# EasyEDA schematic SCH.json

## Sheets
1 power: TITLE: Power; REV: 1.0; Date: 2026-07-29; Sheet: 1/1; Drawn By: rabieulawal.h; Company: Your Company
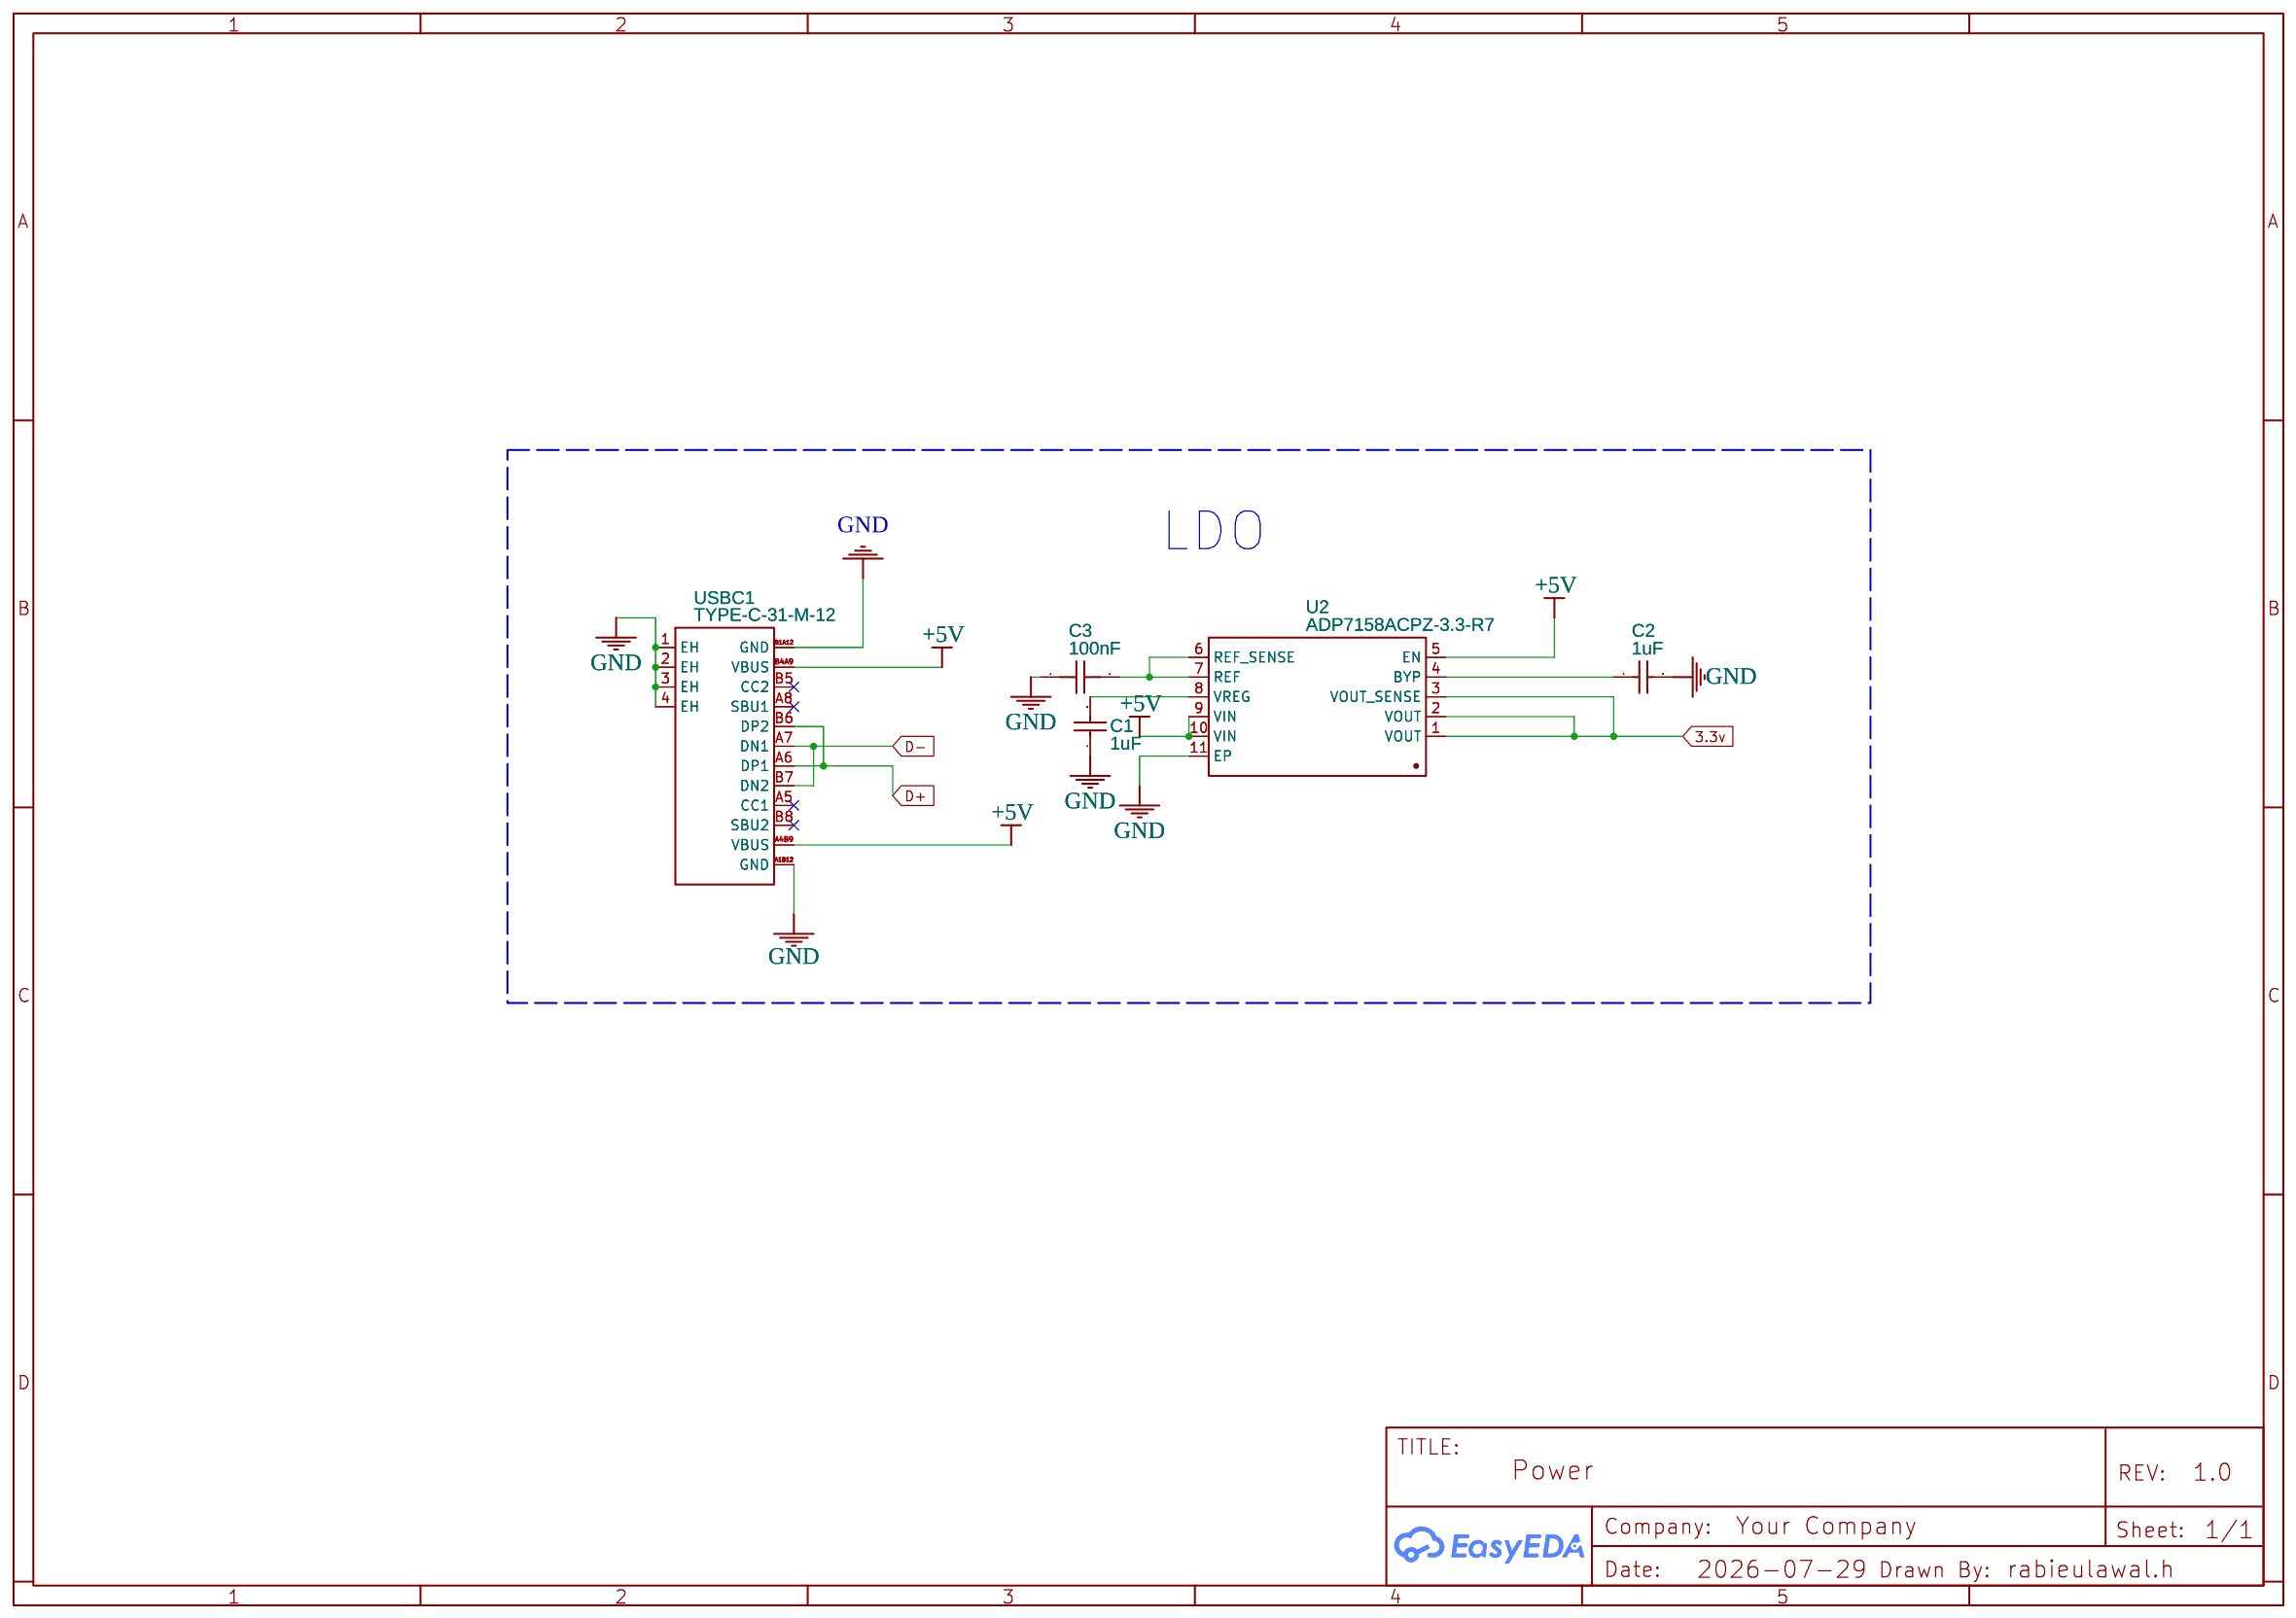
[diagram p0: power]
2 MCU: TITLE: Sheet_1
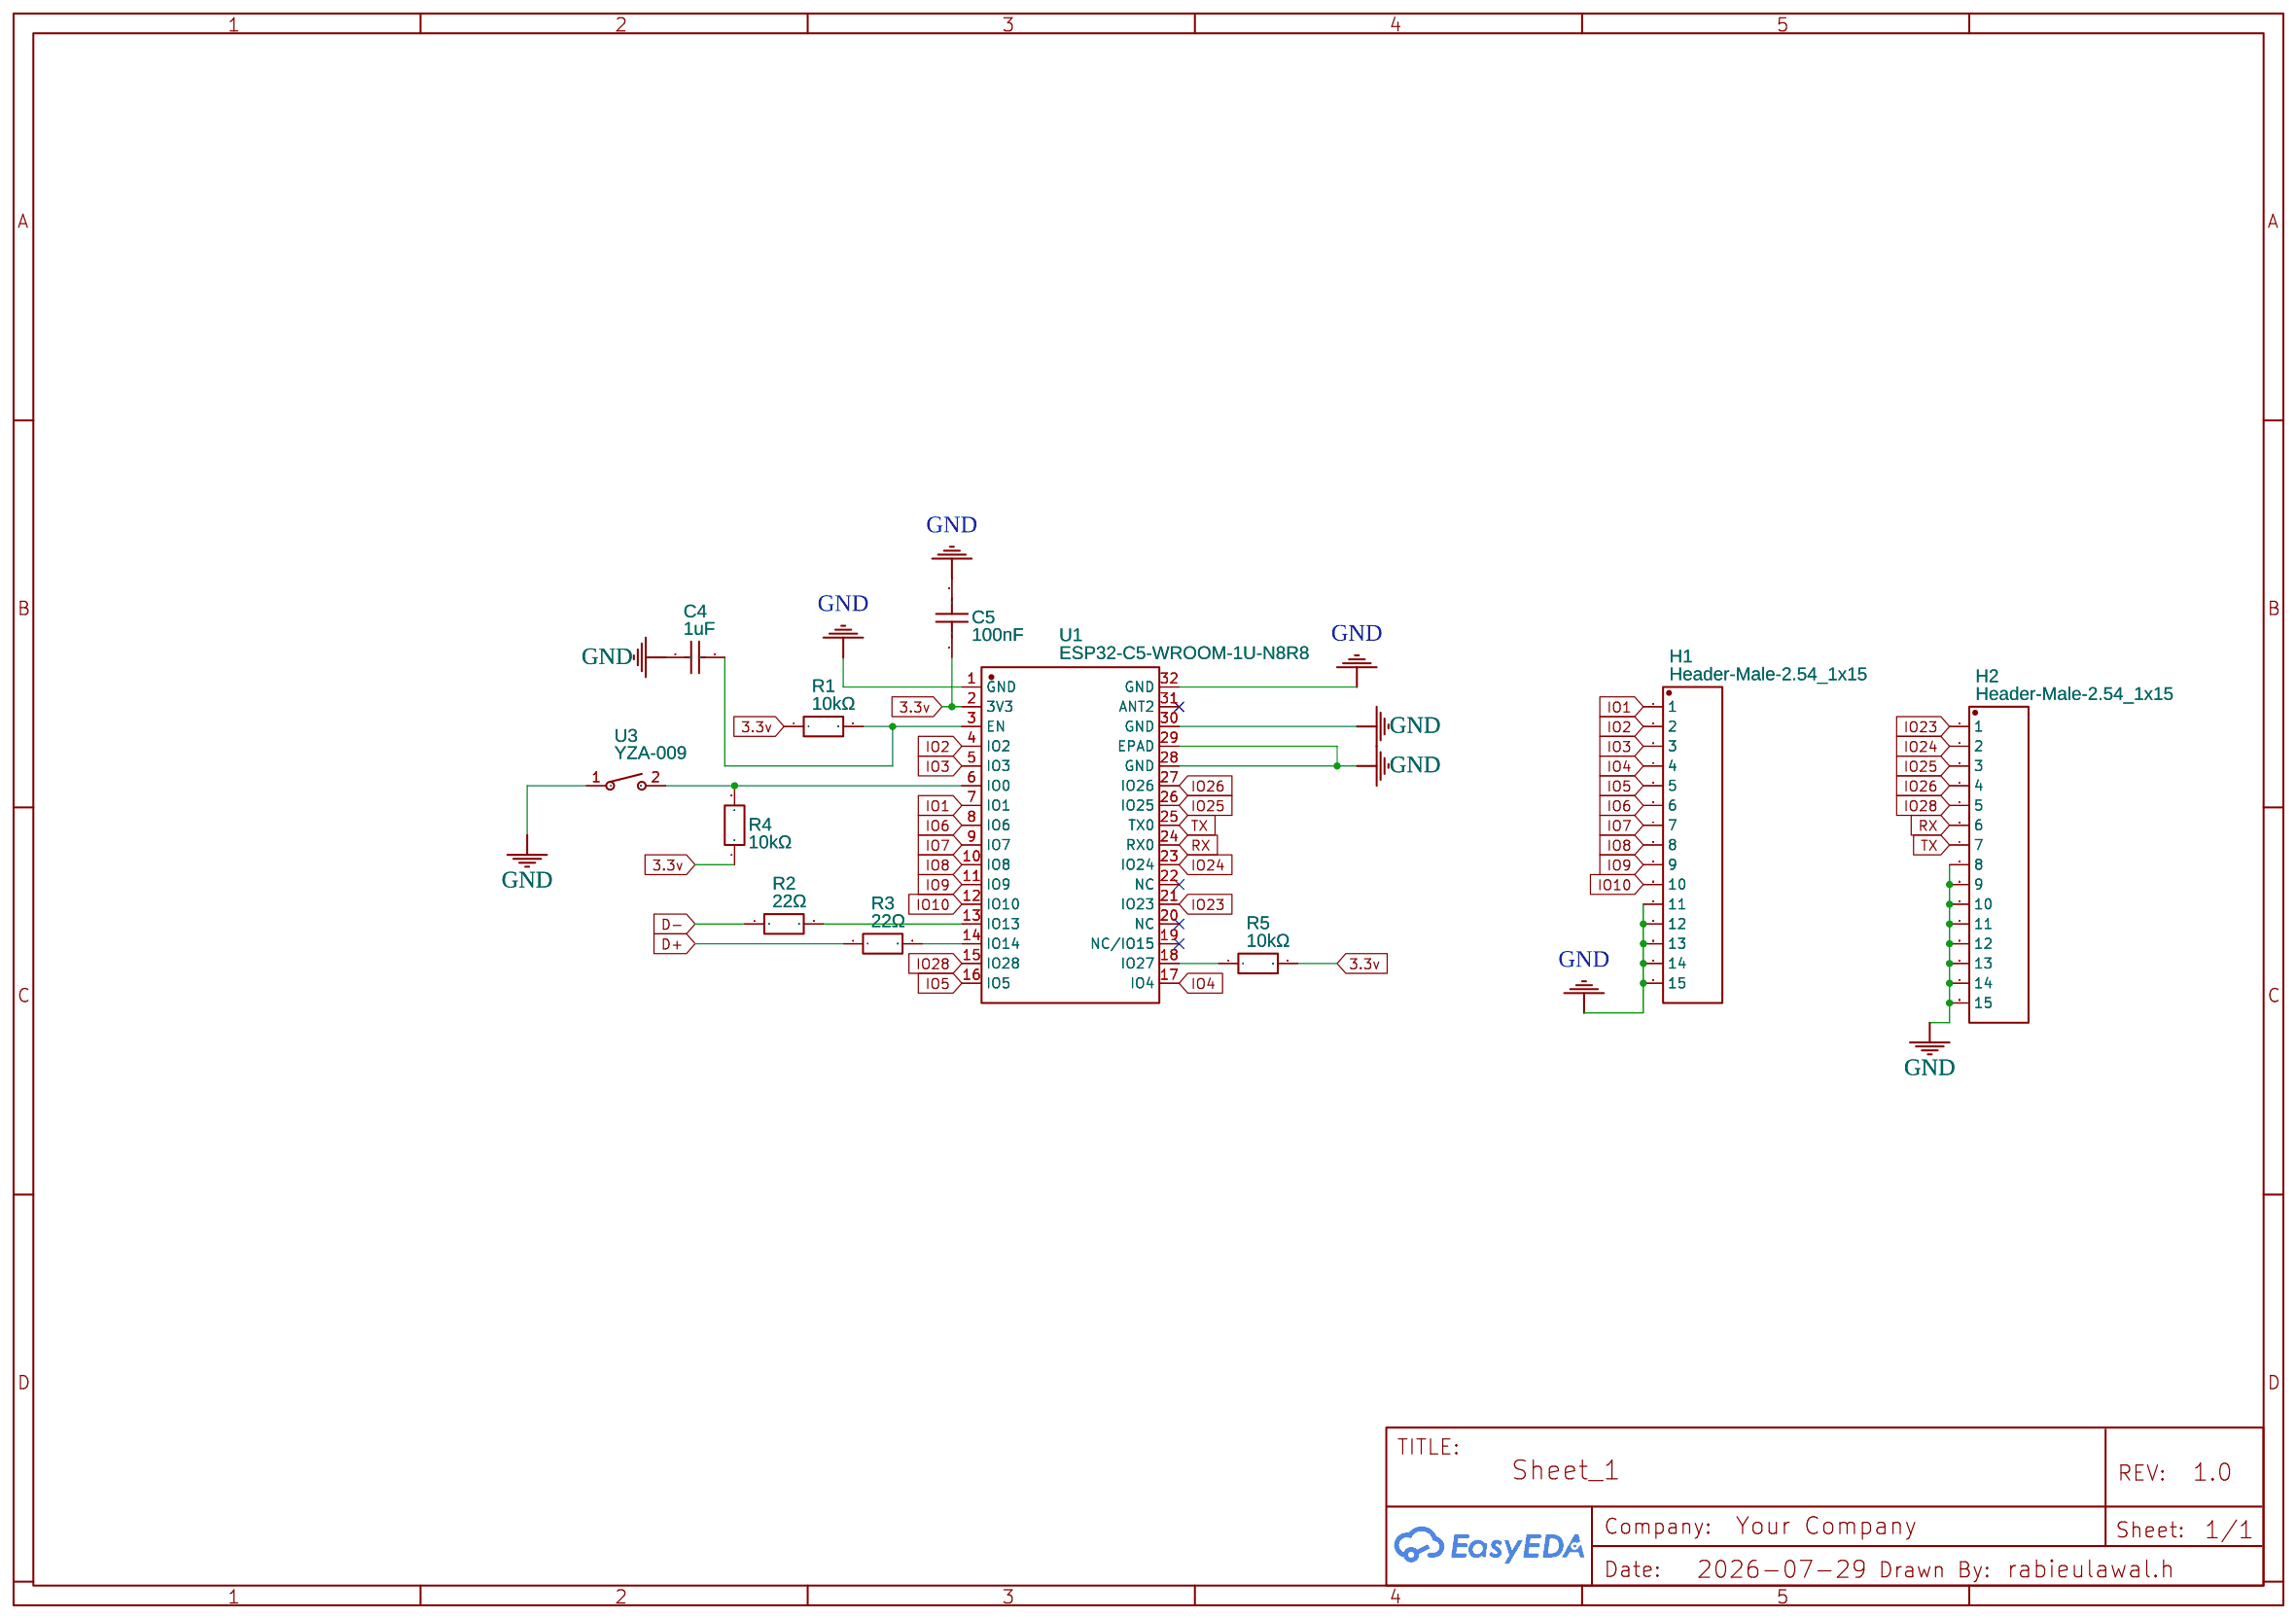
[diagram p1: MCU]

## Parts
sheet MCU
C4  1uF  [C0402]
C5  100nF  [C0402]
H1  Header-Male-2.54_1x15  [HDR-TH_15P-P2.54-V-M]
H2  Header-Male-2.54_1x15  [HDR-TH_15P-P2.54-V-M]
R1  10kΩ  [R0402]
R2  22Ω  [R0805]
R3  22Ω  [R0805]
R4  10kΩ  [R0402]
R5  10kΩ  [R0402]
U1  ESP32-C5-WROOM-1U-N8R8  [COMM-SMD_32P-L21.2-W18.0_ESP32-C5-WROOM-1U]
U3  YZA-009  [SW-SMD_YZA-009]
sheet power
C1  1uF  [C0402]
C2  1uF  [C0402]
C3  100nF  [C0402]
U2  ADP7158ACPZ-3.3-R7  [LFCSP-10_L3.0-W3.0-P0.50-BL-EP]
USBC1  TYPE-C-31-M-12  [USB-C_SMD-TYPE-C-31-M-12_1]

## Library data of the parts
C2 C4 = CL05A105KO5NNNC: Supplier: LCSC; Manufacturer: SAMSUNG(三星); Supplier Part: C29266; JLCPCB Part Class: Extended Part; link: https://lcsc.com/eda_search?q=C29266&%26type=1&ref=editor
C3 C5 = CC0402KRX7R7BB104: Supplier: LCSC; Manufacturer: YAGEO(国巨); Supplier Part: C60474; JLCPCB Part Class: Extended Part
H1 H2 = Header-Male-2.54_1x15: Contributor: LCSC; Supplier: LCSC; Manufacturer: Ckmtw(灿科盟); Manufacturer Part: B-2100S15P-A110; Supplier Part: C124373; JLCPCB Part Class: Extended Part
R1 R4 R5 = FRC0402F1002TS: Contributor: LCSC; Supplier: LCSC; Supplier Part: C2906861; Manufacturer: FOJAN(富捷); JLCPCB Part Class: Extended Part
R2 R3 = FRC0805F22R1TS: Supplier: LCSC; Supplier Part: C2933372; Manufacturer: FOJAN(富捷); JLCPCB Part Class: Extended Part; Contributor: lcsc
U1 = ESP32-C5-WROOM-1U-N8R8: Supplier: LCSC; Supplier Part: C51950748; Manufacturer: ESPRESSIF(乐鑫); JLCPCB Part Class: Extended Part; Contributor: lcsc
U3 = YZA-009: Supplier: LCSC; Supplier Part: C49108621; Manufacturer: YIZHI(逸致); Contributor: lcsc; JLCPCB Part Class: Extended Part
C1 = CL05A105KO5NNNC: Supplier: LCSC; Manufacturer: SAMSUNG(三星); Supplier Part: C29266; JLCPCB Part Class: Extended Part
U2 = ADP7158ACPZ-3.3-R7: Contributor: LCSC; Supplier: LCSC; Supplier Part: C579270; Manufacturer: ADI(亚德诺); JLCPCB Part Class: Extended Part; link: https://lcsc.com/eda_search?q=C579270&%26type=1&ref=editor
USBC1 = TYPE-C-31-M-12: Contributor: LCSC; Supplier: LCSC; Supplier Part: C165948; Manufacturer: 韩国韩荣; JLCPCB Part Class: Extended Part

## Nets
3.3v: C5.1 R1.1 R4.1 R5.2 U1.2(3V3) U2.1(VOUT) U2.2(VOUT) U2.3(VOUT_SENSE)
+5V: U2.5(EN) U2.9(VIN) U2.10(VIN) USBC1.A4B9(VBUS) USBC1.B4A9(VBUS)
GND: C1.1 C2.2 C3.1 C4.2 C5.2 H1.11 H1.12 H1.13 H1.14 H1.15 H2.8 H2.9 H2.10 H2.11 H2.12 H2.13 H2.14 H2.15 U1.1(GND) U1.28(GND) U1.29(EPAD) U1.30(GND) U1.32(GND) U2.11(EP) U3.1 USBC1.1(EH) USBC1.2(EH) USBC1.3(EH) USBC1.4(EH) USBC1.A1B12(GND) USBC1.B1A12(GND)
D+: R3.1 USBC1.A6(DP1) USBC1.B6(DP2)
D-: R2.1 USBC1.A7(DN1) USBC1.B7(DN2)
IO1: H1.1 U1.7(IO1)
IO2: H1.2 U1.4(IO2)
IO3: H1.3 U1.5(IO3)
IO4: H1.4 U1.17(IO4)
IO5: H1.5 U1.16(IO5)
IO6: H1.6 U1.8(IO6)
IO7: H1.7 U1.9(IO7)
IO8: H1.8 U1.10(IO8)
IO9: H1.9 U1.11(IO9)
IO10: H1.10 U1.12(IO10)
IO23: H2.1 U1.21(IO23)
IO24: H2.2 U1.23(IO24)
IO25: H2.3 U1.26(IO25)
IO26: H2.4 U1.27(IO26)
IO28: H2.5 U1.15(IO28)
RX: H2.6 U1.24(RX0)
TX: H2.7 U1.25(TX0)
Net-(C1-2): C1.2 U2.8(VREG)
Net-(C2-1): C2.1 U2.4(BYP)
Net-(C3-2): C3.2 U2.6(REF_SENSE) U2.7(REF)
Net-(C4-1): C4.1 R1.2 U1.3(EN)
Net-(R2-2): R2.2 U1.13(IO13)
Net-(R3-2): R3.2 U1.14(IO14)
Net-(R4-2): R4.2 U1.6(IO0) U3.2
Net-(R5-1): R5.1 U1.18(IO27)

Not connected (* = marked no-connect by the designer): U1 19(NC/IO15)* 20(NC)* 22(NC)* 31(ANT2)*; USBC1 A5(CC1)* A8(SBU1)* B5(CC2)* B8(SBU2)*

## Notes on the sheets
sheet 1
- LDO
